# EAGLE schematic PSPS_AVNC_SRD_fullBoard-2020-05-09-2 (EAGLE 9.5.2)
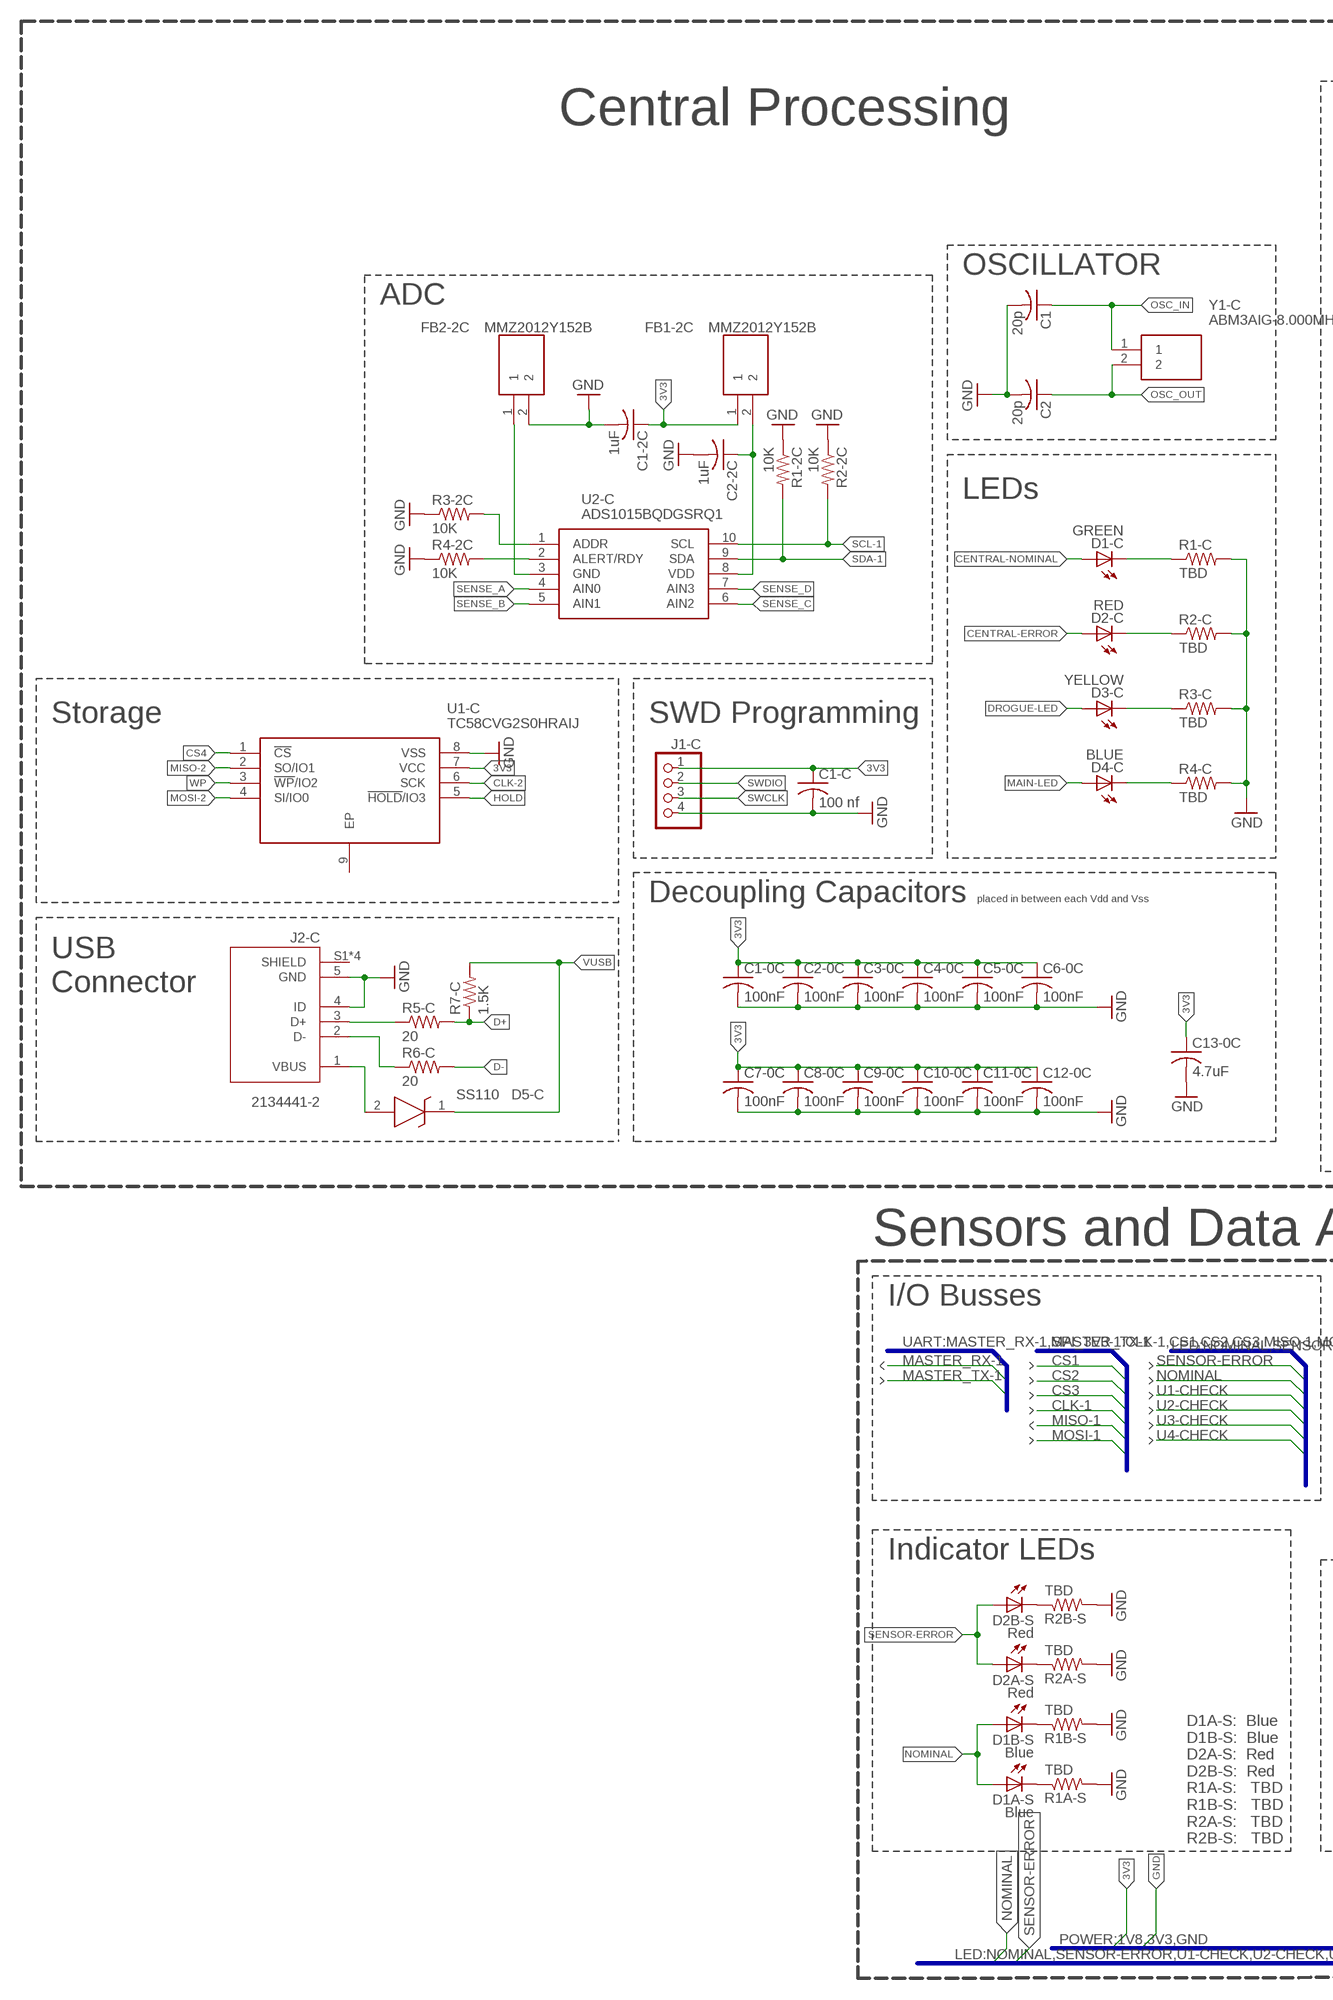
[diagram p0: schematic, sheet 1, part 1 of 3]
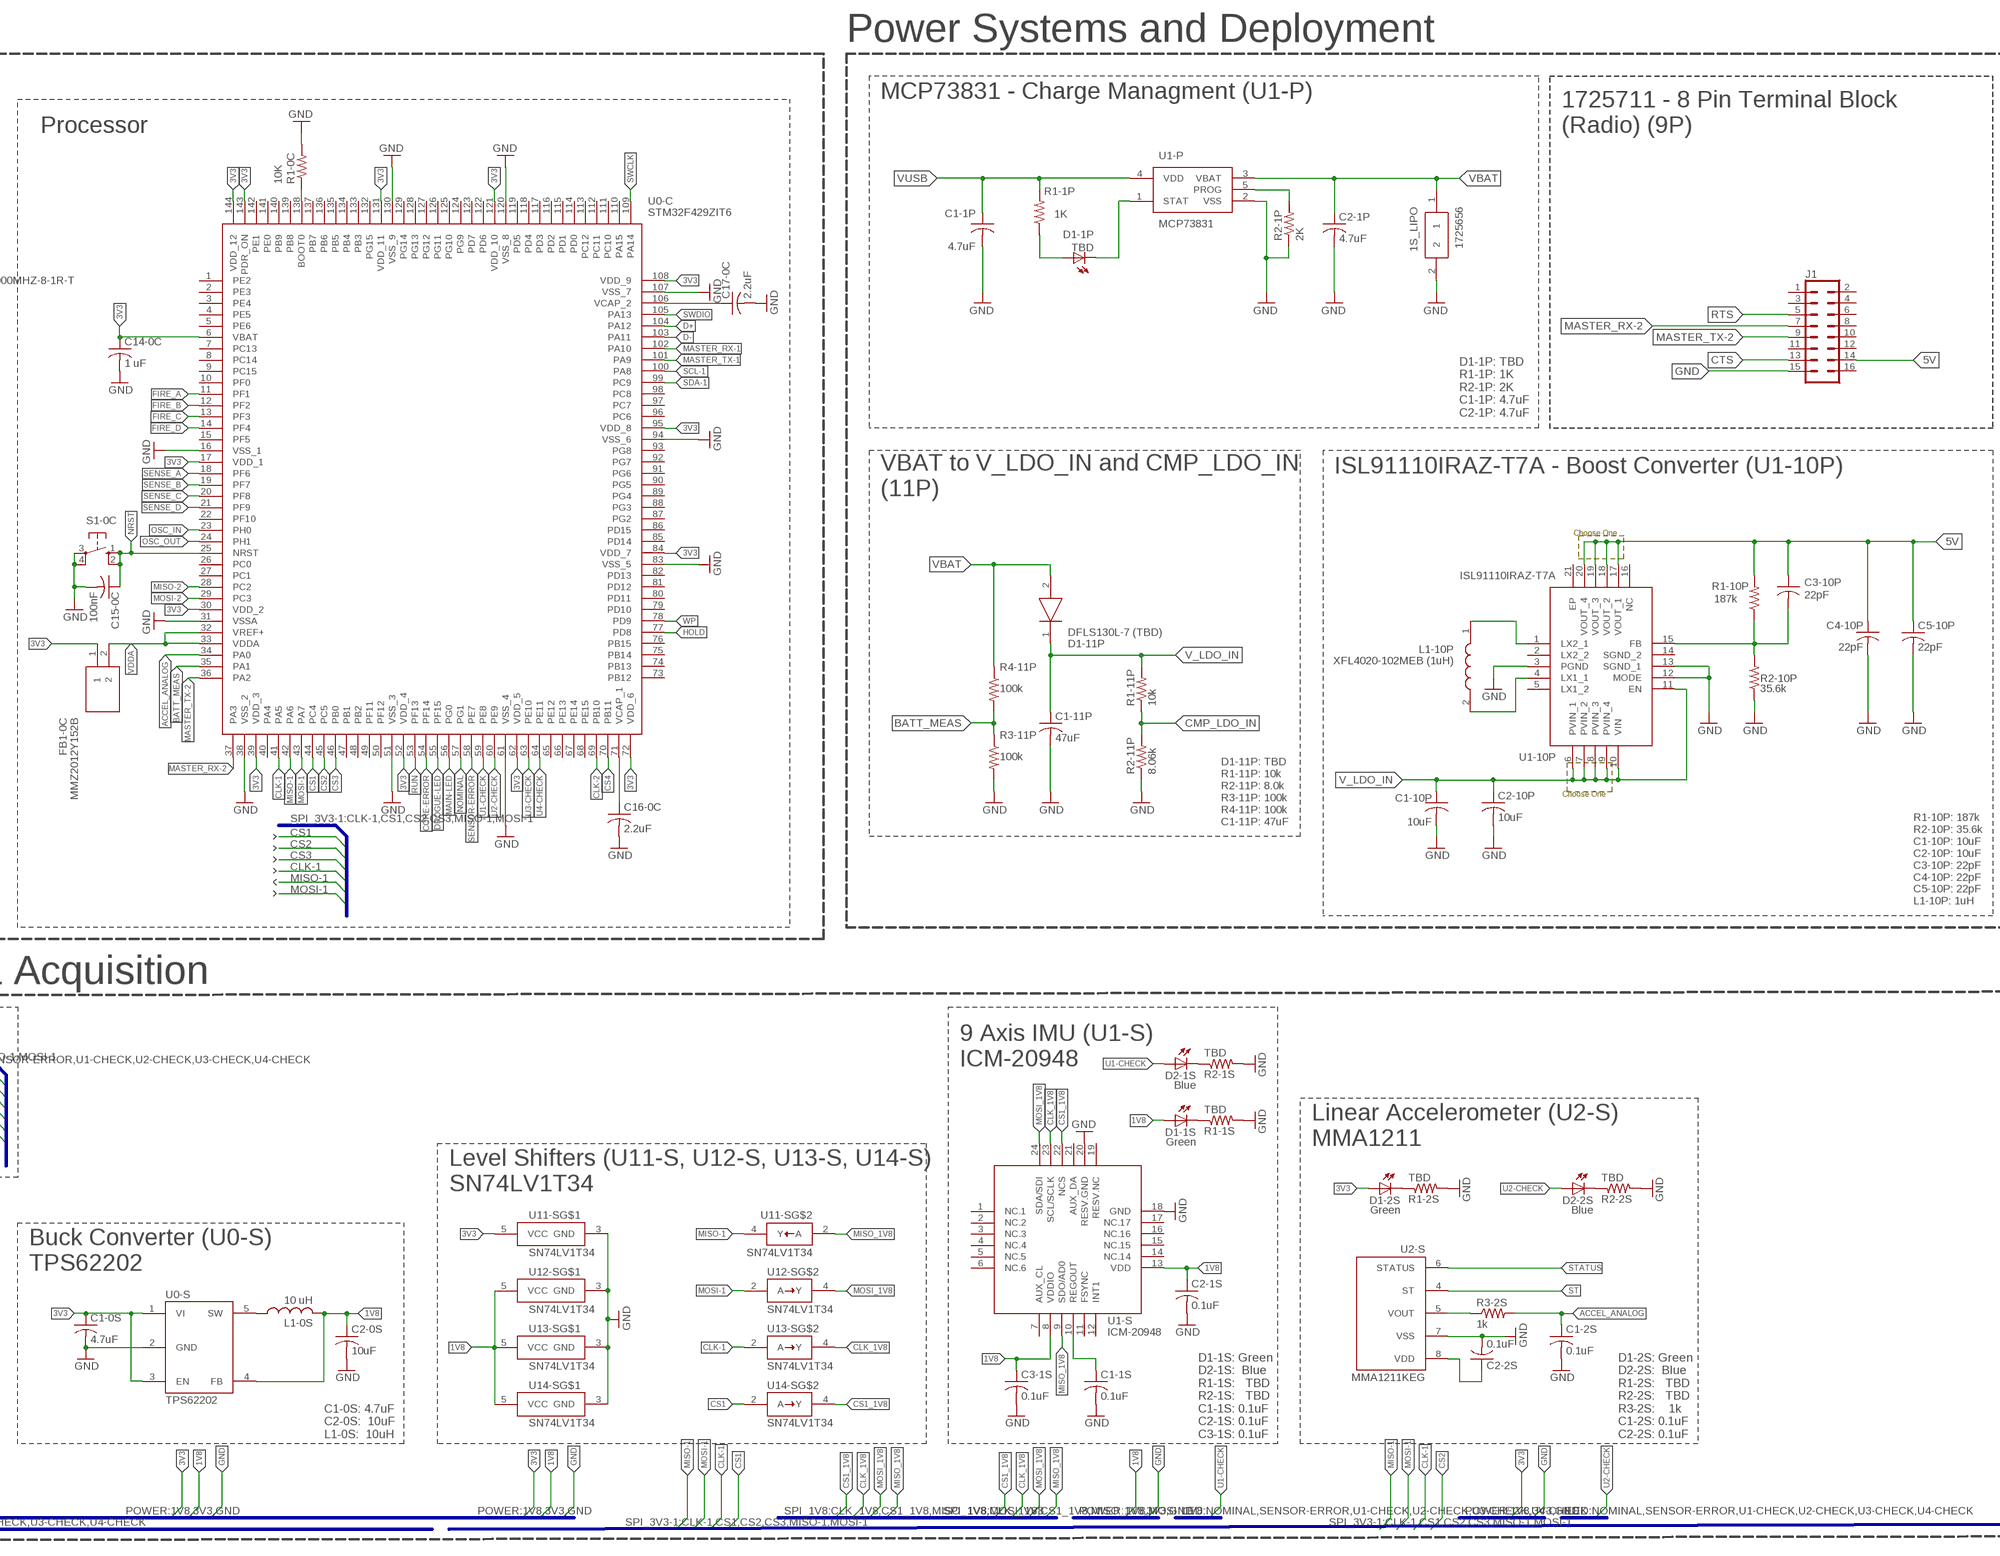
[diagram p1: schematic, sheet 1, part 2 of 3]
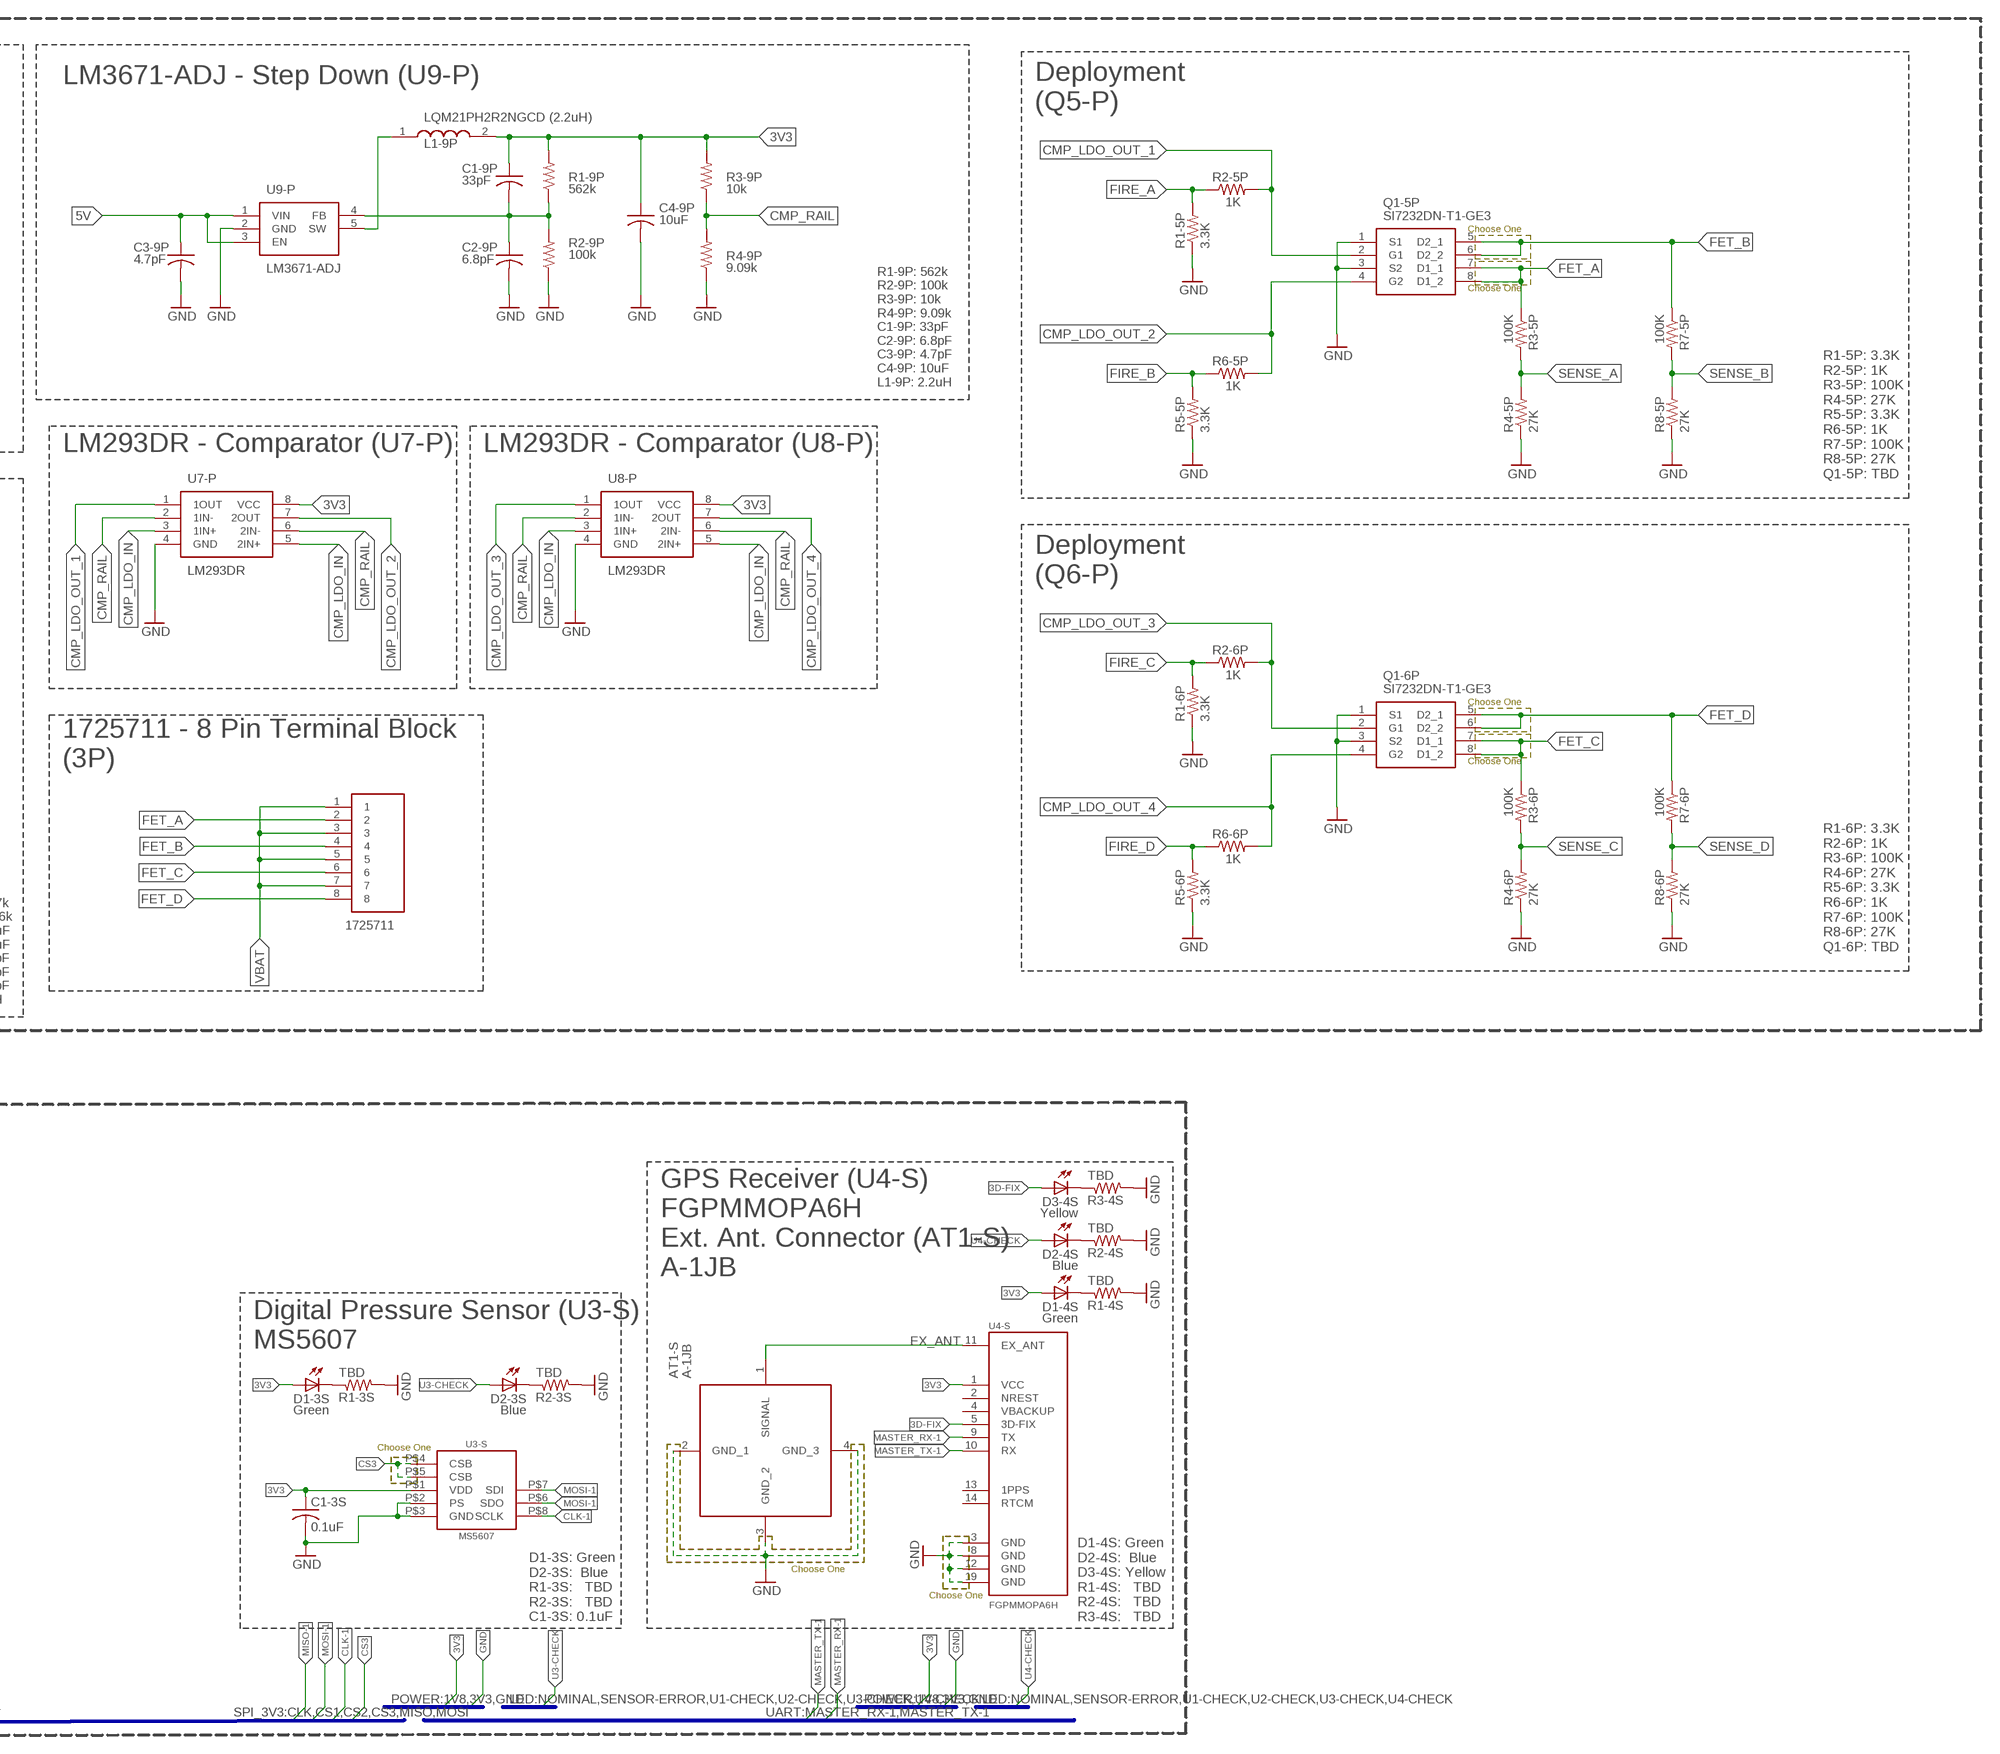
[diagram p2: schematic, sheet 1, part 3 of 3]

## Parts
1S_LIPO  1725656  [1725656]
AT1-S  A-1JB  [A1JB]
C1  20p  C-USC0805  [C0805]
C1-0C  100nF  C-USC0805  [C0805]
C1-0S  4.7uF  C-USC0805  [C0805]
C1-1P  4.7uF  C-USC0805  [C0805]
C1-1S  0.1uF  C-USC0805  [C0805]
C1-2C  1uF  C-USC0805  [C0805]
C1-2S  0.1uF  C-USC0805  [C0805]
C1-3S  0.1uF  C-USC0805  [C0805]
C1-9P  33pF  C-USC0805  [C0805]
C1-10P  10uF  C-USC0805  [C0805]
C1-11P  47uF  C-USC0805  [C0805]
C1-C  100 nf  C-USC0805  [C0805]
C2  20p  C-USC0805  [C0805]
C2-0C  100nF  C-USC0805  [C0805]
C2-0S  10uF  C-USC0805  [C0805]
C2-1P  4.7uF  C-USC0805  [C0805]
C2-1S  0.1uF  C-USC0805  [C0805]
C2-2C  1uF  C-USC0805  [C0805]
C2-2S  0.1uF  C-USC0805  [C0805]
C2-9P  6.8pF  C-USC0805  [C0805]
C2-10P  10uF  C-USC0805  [C0805]
C3-0C  100nF  C-USC0805  [C0805]
C3-1S  0.1uF  C-USC0805  [C0805]
C3-9P  4.7pF  C-USC0805  [C0805]
C3-10P  22pF  C-USC0805  [C0805]
C4-0C  100nF  C-USC0805  [C0805]
C4-9P  10uF  C-USC0805  [C0805]
C4-10P  22pF  C-USC0805  [C0805]
C5-0C  100nF  C-USC0805  [C0805]
C5-10P  22pF  C-USC0805  [C0805]
C6-0C  100nF  C-USC0805  [C0805]
C7-0C  100nF  C-USC0805  [C0805]
C8-0C  100nF  C-USC0805  [C0805]
C9-0C  100nF  C-USC0805  [C0805]
C10-0C  100nF  C-USC0805  [C0805]
C11-0C  100nF  C-USC0805  [C0805]
C12-0C  100nF  C-USC0805  [C0805]
C13-0C  4.7uF  C-USC0805  [C0805]
C14-0C  1 uF  C-USC0805  [C0805]
C15-0C  100nF  C-USC0805  [C0805]
C16-0C  2.2uF  C-USC0805  [C0805]
C17-0C  2.2uF  C-USC0805  [C0805]
D1-1P  TBD  LEDCHIPLED_0805  [CHIPLED_0805]
D1-1S  Green  LEDCHIPLED_0805  [CHIPLED_0805]
D1-2S  Green  LEDCHIPLED_0805  [CHIPLED_0805]
D1-3S  Green  LEDCHIPLED_0805  [CHIPLED_0805]
D1-4S  Green  LEDCHIPLED_0805  [CHIPLED_0805]
D1-11P  DFLS130L-7 (TBD)  DFLS130L-7  [POWERDI_123]
D1-C  GREEN  LEDCHIPLED_0805  [CHIPLED_0805]
D1A-S  Blue  LEDCHIPLED_0805  [CHIPLED_0805]
D1B-S  Blue  LEDCHIPLED_0805  [CHIPLED_0805]
D2-1S  Blue  LEDCHIPLED_0805  [CHIPLED_0805]
D2-2S  Blue  LEDCHIPLED_0805  [CHIPLED_0805]
D2-3S  Blue  LEDCHIPLED_0805  [CHIPLED_0805]
D2-4S  Blue  LEDCHIPLED_0805  [CHIPLED_0805]
D2-C  RED  LEDCHIPLED_0805  [CHIPLED_0805]
D2A-S  Red  LEDCHIPLED_0805  [CHIPLED_0805]
D2B-S  Red  LEDCHIPLED_0805  [CHIPLED_0805]
D3-4S  Yellow  LEDCHIPLED_0805  [CHIPLED_0805]
D3-C  YELLOW  LEDCHIPLED_0805  [CHIPLED_0805]
D4-C  BLUE  LEDCHIPLED_0805  [CHIPLED_0805]
D5-C  SS110  [SS110]
FB1-0C  MMZ2012Y152B  [BEADC2012X105N]
FB1-2C  MMZ2012Y152B  [BEADC2012X105N]
FB2-2C  MMZ2012Y152B  [BEADC2012X105N]
J1  CONN_08X2  [2X8]
J1-C  PINHD-1X4  [1X04]
J2-C  2134441-2  [TE_2134441-2]
J2-CHARGETERMINAL  1725711  [1725711]
L1-0S  10 uH  PF0560.103NLT  [PF0560NL]
L1-9P  LQM21PH2R2NGCD (2.2uH)  LQM21PH2R2NGCD  [INDC2012X100N]
L1-10P  XFL4020-102MEB (1uH)  XFL4020-102MEB  [XFL4020]
Q1-5P  SI7232DN-T1-GE3  [POWERPAK-1212-8]
Q1-6P  SI7232DN-T1-GE3  [POWERPAK-1212-8]
R1-0C  10K  R-US_R0805  [R0805]
R1-1P  1K  R-US_R0805  [R0805]
R1-1S  TBD  R-US_R0805  [R0805]
R1-2C  10K  R-US_R0805  [R0805]
R1-2S  TBD  R-US_R0805  [R0805]
R1-3S  TBD  R-US_R0805  [R0805]
R1-4S  TBD  R-US_R0805  [R0805]
R1-5P  3.3K  R-US_M0805  [M0805]
R1-6P  3.3K  R-US_M0805  [M0805]
R1-9P  562k  R-US_R0805  [R0805]
R1-10P  187k  R-US_R0805  [R0805]
R1-11P  10k  R-US_R0805  [R0805]
R1-C  TBD  R-US_M0805  [M0805]
R1A-S  TBD  R-US_R0805  [R0805]
R1B-S  TBD  R-US_R0805  [R0805]
R2-1P  2K  R-US_R0805  [R0805]
R2-1S  TBD  R-US_R0805  [R0805]
R2-2C  10K  R-US_R0805  [R0805]
R2-2S  TBD  R-US_R0805  [R0805]
R2-3S  TBD  R-US_R0805  [R0805]
R2-4S  TBD  R-US_R0805  [R0805]
R2-5P  1K  R-US_M0805  [M0805]
R2-6P  1K  R-US_M0805  [M0805]
R2-9P  100k  R-US_R0805  [R0805]
R2-10P  35.6k  R-US_R0805  [R0805]
R2-11P  8.06k  R-US_R0805  [R0805]
R2-C  TBD  R-US_M0805  [M0805]
R2A-S  TBD  R-US_R0805  [R0805]
R2B-S  TBD  R-US_R0805  [R0805]
R3-2C  10K  R-US_R0805  [R0805]
R3-2S  1k  R-US_R0805  [R0805]
R3-4S  TBD  R-US_R0805  [R0805]
R3-5P  100K  R-US_M0805  [M0805]
R3-6P  100K  R-US_M0805  [M0805]
R3-9P  10k  R-US_R0805  [R0805]
R3-11P  100k  R-US_R0805  [R0805]
R3-C  TBD  R-US_M0805  [M0805]
R4-2C  10K  R-US_R0805  [R0805]
R4-5P  27K  R-US_M0805  [M0805]
R4-6P  27K  R-US_M0805  [M0805]
R4-9P  9.09k  R-US_R0805  [R0805]
R4-11P  100k  R-US_R0805  [R0805]
R4-C  TBD  R-US_M0805  [M0805]
R5-5P  3.3K  R-US_M0805  [M0805]
R5-6P  3.3K  R-US_M0805  [M0805]
R5-C  20  R-US_M0805  [M0805]
R6-5P  1K  R-US_M0805  [M0805]
R6-6P  1K  R-US_M0805  [M0805]
R6-C  20  R-US_M0805  [M0805]
R7-5P  100K  R-US_M0805  [M0805]
R7-6P  100K  R-US_M0805  [M0805]
R7-C  1.5K  R-US_M0805  [M0805]
R8-5P  27K  R-US_M0805  [M0805]
R8-6P  27K  R-US_M0805  [M0805]
S1-0C  10-XX  [B3F-10XX]
U0-C  STM32F429ZIT6  [QFP50P2200X2200X160-144N]
U0-S  TPS62202  [SOT95P280X145-5]
U1-10P  ISL91110IRAZ-T7A  [QFN50P400X400X100-21N]
U1-C  TC58CVG2S0HRAIJ  [SON127P800X600X80-9N]
U1-P  MCP73831  MCP73831T-2ACI_OT  [SOT95P270X145-5N]
U1-S  ICM-20948  [QFN40P300X300X105-25T159X175]
U2-C  ADS1015BQDGSRQ1  [SOP50P490X110-10N]
U2-S  MMA1211KEG  [SOIC127P1041X355-16N]
U3-S  MS5607  [MS5607]
U4-S  FGPMMOPA6H  [SOIC127P1800X470-20N]
U7-P  LM293DR  [SOIC127P600X175-8N]
U8-P  LM293DR  [SOIC127P600X175-8N]
U9-P  LM3671-ADJ  LM3671MFX-ADJ_NOPB  [SOT95P280X145-5N]
U11-S  SN74LV1T34  [SOT65P210X110-5]
U12-S  SN74LV1T34  [SOT65P210X110-5]
U13-S  SN74LV1T34  [SOT65P210X110-5]
U14-S  SN74LV1T34  [SOT65P210X110-5]
Y1-C  ABM3AIG-8.000MHZ-8-1R-T  [ABM3AIG8000MHZ81RT]

## Nets
1V8: C2-0S.1 C2-1S.1 C3-1S.1 D1-1S.A L1-0S.P$2 U0-S.4(FB) U1-S.8(VDDIO) U1-S.13(VDD) U12-S.5(VCC) U13-S.5(VCC) U14-S.5(VCC)
3D-FIX: D3-4S.A U4-S.5(3D-FIX)
3V3: C1-0C.1 C1-0S.1 C1-2C.1 C1-3S.1 C1-9P.1 C1-C.1 C2-0C.1 C3-0C.1 C4-0C.1 C4-9P.1 C5-0C.1 C6-0C.1 C7-0C.1 C8-0C.1 C9-0C.1 C10-0C.1 C11-0C.1 C12-0C.1 C13-0C.1 C14-0C.1 D1-2S.A D1-3S.A D1-4S.A FB1-0C.1 FB1-2C.1 J1-C.1 L1-9P.2 R1-9P.2 R3-9P.2 U0-C.6(VBAT) U0-C.17(VDD_1) U0-C.30(VDD_2) U0-C.39(VDD_3) U0-C.52(VDD_4) U0-C.62(VDD_5) U0-C.72(VDD_6) U0-C.84(VDD_7) U0-C.95(VDD_8) U0-C.108(VDD_9) U0-C.121(VDD_10) U0-C.131(VDD_11) U0-C.143(PDR_ON) U0-C.144(VDD_12) U0-S.1(VI) U0-S.3(EN) U1-C.7(VCC) U3-S.P$1(VDD) U4-S.1(VCC) U7-P.8(VCC) U8-P.8(VCC) U11-S.5(VCC)
3V3-U2-CA: C2-2C.1 FB1-2C.2 U2-C.8(VDD)
5V: C3-9P.1 C3-10P.1 C4-10P.1 C5-10P.1 J1.14 R1-10P.2 U1-10P.17(VOUT_1) U1-10P.18(VOUT_2) U1-10P.19(VOUT_3) U1-10P.20(VOUT_4) U9-P.1(VIN) U9-P.3(EN)
ACCEL_ANALOG: C1-2S.1 R3-2S.2 U0-C.34(PA0)
ADDR: R3-2C.2 U2-C.1(ADDR)
ALERT: R4-2C.2 U2-C.2(ALERT/RDY)
BATT_MEAS: R3-11P.1 R4-11P.2 U0-C.35(PA1)
BOOT0: R1-0C.1 U0-C.138(BOOT0)
CENTRAL-ERROR: D2-C.A
CENTRAL-NOMINAL: D1-C.A
CLK-1: U0-C.41(PA5) U3-S.P$8(SCLK) U13-S.2(A)
CLK-2: U0-C.69(PB10) U1-C.6(SCK)
CLK_1V8: U1-S.23(SCL/SCLK) U13-S.4(Y)
CMP_LDO_IN: R1-11P.1 R2-11P.2 U7-P.3(1IN+) U7-P.5(2IN+) U8-P.3(1IN+) U8-P.5(2IN+)
CMP_LDO_OUT_1: Q1-5P.2(G1) R2-5P.2 U7-P.1(1OUT)
CMP_LDO_OUT_2: Q1-5P.4(G2) R6-5P.2 U7-P.7(2OUT)
CMP_LDO_OUT_3: Q1-6P.2(G1) R2-6P.2 U8-P.1(1OUT)
CMP_LDO_OUT_4: Q1-6P.4(G2) R6-6P.2 U8-P.7(2OUT)
CMP_RAIL: R3-9P.1 R4-9P.2 U7-P.2(1IN-) U7-P.6(2IN-) U8-P.2(1IN-) U8-P.6(2IN-)
CORE-ERROR: U0-C.54(PF14)
CS1: U0-C.44(PC4) U14-S.2(A)
CS1_1V8: U1-S.22(NCS) U14-S.4(Y)
CS2: U0-C.45(PC5)
CS3: U0-C.46(PB0) U3-S.P$4(CSB) U3-S.P$5(CSB)
CS4: U0-C.70(PB11) U1-C.1(!CS)
CTS: J1.13
D1-1S_R1-1S: D1-1S.C R1-1S.1
D1-2S_R1-2S: D1-2S.C R1-2S.1
D1-3S_R1-3S: D1-3S.C R1-3S.1
D1-4S_R1-4S: D1-4S.C R1-4S.1
D1-C_R1-C: D1-C.C R1-C.1
D1A-S_R1A-S: D1A-S.C R1A-S.1
D1B-S_R1B-S: D1B-S.C R1B-S.1
D2-1S_R2-1S: D2-1S.C R2-1S.1
D2-2S_R2-2S: D2-2S.C R2-2S.1
D2-3S_R2-3S: D2-3S.C R2-3S.1
D2-4S_R2-4S: D2-4S.C R2-4S.1
D2-C_R2-C: D2-C.C R2-C.1
D2A-S_R2A-S: D2A-S.C R2A-S.1
D2B-S_R2B-S: D2B-S.C R2B-S.1
D3-4S_R3-4S: D3-4S.C R3-4S.1
D3-C_R3-C: D3-C.C R3-C.1
D4-C_R4-C: D4-C.C R4-C.1
D+: R5-C.2 R7-C.1 U0-C.104(PA12)
D-: R6-C.2 U0-C.103(PA11)
DROGUE-LED: D3-C.A U0-C.55(PF15)
EX_ANT: AT1-S.1(SIGNAL) U4-S.11(EX_ANT)
FET_A: J2-CHARGETERMINAL.2 Q1-5P.7(D1_1) Q1-5P.8(D1_2) R3-5P.1
FET_B: J2-CHARGETERMINAL.4 Q1-5P.5(D2_1) Q1-5P.6(D2_2) R7-5P.1
FET_C: J2-CHARGETERMINAL.6 Q1-6P.7(D1_1) Q1-6P.8(D1_2) R3-6P.1
FET_D: J2-CHARGETERMINAL.8 Q1-6P.5(D2_1) Q1-6P.6(D2_2) R7-6P.1
FIRE_A: R1-5P.2 R2-5P.1 U0-C.11(PF1)
FIRE_B: R5-5P.2 R6-5P.1 U0-C.12(PF2)
FIRE_C: R1-6P.2 R2-6P.1 U0-C.13(PF3)
FIRE_D: R5-6P.2 R6-6P.1 U0-C.14(PF4)
GND: 1S_LIPO.2 AT1-S.2(GND_1) AT1-S.3(GND_2) AT1-S.4(GND_3) C1-0C.2 C1-0S.2 C1-1S.2 C1-2C.2 C1-2S.2 C1-3S.2 C1-10P.2 C1-11P.2 C1-C.2 C1.2 C2-0C.2 C2-0S.2 C2-1P.2 C2-1S.2 C2-2C.2 C2-2S.2 C2-9P.2 C2-10P.2 C2.2 C3-0C.2 C3-1S.2 C3-9P.2 C4-0C.2 C4-9P.2 C4-10P.2 C5-0C.2 C5-10P.2 C6-0C.2 C7-0C.2 C8-0C.2 C9-0C.2 C10-0C.2 C11-0C.2 C12-0C.2 C13-0C.2 C14-0C.2 C15-0C.2 C16-0C.2 C17-0C.2 FB2-2C.2 J1-C.4 J1.15 J2-C.4(ID) J2-C.5(GND) Q1-5P.1(S1) Q1-5P.3(S2) Q1-6P.1(S1) Q1-6P.3(S2) R1-0C.2 R1-1S.2 R1-2C.1 R1-2S.2 R1-3S.2 R1-4S.2 R1-5P.1 R1-6P.1 R1-C.2 R1A-S.2 R1B-S.2 R2-1P.1 R2-1S.2 R2-2C.1 R2-2S.2 R2-3S.2 R2-4S.2 R2-9P.1 R2-10P.1 R2-11P.1 R2-C.2 R2A-S.2 R2B-S.2 R3-2C.1 R3-4S.2 R3-11P.2 R3-C.2 R4-2C.1 R4-5P.1 R4-6P.1 R4-9P.1 R4-C.2 R5-5P.1 R5-6P.1 R8-5P.1 R8-6P.1 S1-0C.3(P) S1-0C.4(P1) U0-C.16(VSS_1) U0-C.31(VSSA) U0-C.38(VSS_2) U0-C.51(VSS_3) U0-C.61(VSS_4) U0-C.83(VSS_5) U0-C.94(VSS_6) U0-C.107(VSS_7) U0-C.120(VSS_8) U0-C.130(VSS_9) U0-S.2(GND) U1-10P.3(PGND) U1-10P.12(MODE) U1-10P.13(SGND_1) U1-C.8(VSS) U1-P.2(VSS) U1-S.18(GND) U1-S.20(RESV.GND) U2-S.7(VSS) U3-S.P$2(PS) U3-S.P$3(GND) U4-S.3(GND) U4-S.8(GND) U4-S.12(GND) U4-S.19(GND) U7-P.4(GND) U8-P.4(GND) U9-P.2(GND) U11-S.3(GND) U12-S.3(GND) U13-S.3(GND) U14-S.3(GND)
GND-U2-CA: FB2-2C.1 U2-C.3(GND)
HOLD: U0-C.77(PD8) U1-C.5(!HOLD!/IO3)
MAIN-LED: D4-C.A U0-C.56(PG0)
MASTER_RX-1: U0-C.102(PA10) U4-S.9(TX)
MASTER_RX-2: J1.7 U0-C.37(PA3)
MASTER_TX-1: U0-C.101(PA9) U4-S.10(RX)
MASTER_TX-2: J1.9 U0-C.36(PA2)
MISO-1: U0-C.42(PA6) U11-S.4(Y)
MISO-2: U0-C.28(PC2) U1-C.2(SO/IO1)
MISO_1V8: U1-S.9(SDO/AD0) U11-S.2(A)
MOSI-1: U0-C.43(PA7) U3-S.P$6(SDO) U3-S.P$7(SDI) U12-S.2(A)
MOSI-2: U0-C.29(PC3) U1-C.4(SI/IO0)
MOSI_1V8: U1-S.24(SDA/SDI) U12-S.4(Y)
N$1: C3-10P.2 R1-10P.1 R2-10P.2 U1-10P.15(FB)
N$3: J2-C.3(D+) R5-C.1
N$4: J2-C.2(D-) R6-C.1
N$5: C2-2S.1 U2-S.8(VDD)
N$6: C1-9P.2 C2-9P.1 R1-9P.1 R2-9P.2 U9-P.4(FB)
N$7: L1-9P.1 U9-P.5(SW)
N$8: L1-10P.1 U1-10P.1(LX2_1)
N$9: L1-10P.2 U1-10P.4(LX1_1)
N$13: D1-1P.A R1-1P.1
N$14: D1-1P.C U1-P.1(STAT)
N$16: C1-1P.2 ; supply symbol labelled GND
N$17: R2-1P.2 U1-P.5(PROG)
NOMINAL: D1A-S.A D1B-S.A U0-C.57(PG1)
NRST: C15-0C.1 S1-0C.1(S) S1-0C.2(S1) U0-C.25(NRST)
OSC_IN: C1.1 U0-C.23(PH0) Y1-C.1
OSC_OUT: C2.1 U0-C.24(PH1) Y1-C.2
REGOUT: C1-1S.1 U1-S.10(REGOUT)
RTS: J1.5
RUN: U0-C.53(PF13)
SCL-1: R2-2C.2 U0-C.100(PA8) U2-C.10(SCL)
SDA-1: R1-2C.2 U0-C.99(PC9) U2-C.9(SDA)
SENSE_A: R3-5P.2 R4-5P.2 U0-C.18(PF6) U2-C.4(AIN0)
SENSE_B: R7-5P.2 R8-5P.2 U0-C.19(PF7) U2-C.5(AIN1)
SENSE_C: R3-6P.2 R4-6P.2 U0-C.20(PF8) U2-C.6(AIN2)
SENSE_D: R7-6P.2 R8-6P.2 U0-C.21(PF9) U2-C.7(AIN3)
SENSOR-ERROR: D2A-S.A D2B-S.A U0-C.58(PE7)
ST: U2-S.4(ST)
STATUS: U2-S.6(STATUS)
SW: L1-0S.P$1 U0-S.5(SW)
SWCLK: J1-C.3 U0-C.109(PA14)
SWDIO: J1-C.2 U0-C.105(PA13)
U1-CHECK: D2-1S.A U0-C.59(PE8)
U2-CHECK: D2-2S.A U0-C.60(PE9)
U3-CHECK: D2-3S.A U0-C.63(PE10)
U4-CHECK: D2-4S.A U0-C.64(PE11)
V_LDO_IN: C1-10P.1 C1-11P.1 C2-10P.1 D1-11P.1(K) R1-11P.2 U1-10P.6(PVIN_1) U1-10P.7(PVIN_2) U1-10P.8(PVIN_3) U1-10P.9(PVIN_4) U1-10P.10(VIN) U1-10P.11(EN)
VBAT: 1S_LIPO.1 C2-1P.1 D1-11P.2(A) J2-CHARGETERMINAL.1 J2-CHARGETERMINAL.3 J2-CHARGETERMINAL.5 J2-CHARGETERMINAL.7 R4-11P.1 U1-P.3(VBAT)
VCAP_1: C16-0C.1 U0-C.71(VCAP_1)
VCAP_2: C17-0C.1 U0-C.106(VCAP_2)
VDDA: FB1-0C.2 U0-C.32(VREF+) U0-C.33(VDDA)
VOUT: R3-2S.1 U2-S.5(VOUT)
VUSB: C1-1P.1 D5-C.1(CATHODE) D5-C.2(ANODE) J2-C.1(VBUS) R1-1P.2 R7-C.2 U1-P.4(VDD)
WP: U0-C.78(PD9) U1-C.3(!WP!/IO2)
Unconnected: J1.1 J1.2 J1.3 J1.4 J1.6 J1.8 J1.10 J1.11 J1.12 J1.16 U0-C.1(PE2) U0-C.2(PE3) U0-C.3(PE4) U0-C.4(PE5) U0-C.5(PE6) U0-C.7(PC13) U0-C.8(PC14) U0-C.9(PC15) U0-C.10(PF0) U0-C.15(PF5) U0-C.22(PF10) U0-C.26(PC0) U0-C.27(PC1) U0-C.40(PA4) U0-C.47(PB1) U0-C.48(PB2) U0-C.49(PF11) U0-C.50(PF12) U0-C.65(PE12) U0-C.66(PE13) U0-C.67(PE14) U0-C.68(PE15) U0-C.73(PB12) U0-C.74(PB13) U0-C.75(PB14) U0-C.76(PB15) U0-C.79(PD10) U0-C.80(PD11) U0-C.81(PD12) U0-C.82(PD13) U0-C.85(PD14) U0-C.86(PD15) U0-C.87(PG2) U0-C.88(PG3) U0-C.89(PG4) U0-C.90(PG5) U0-C.91(PG6) U0-C.92(PG7) U0-C.93(PG8) U0-C.96(PC6) U0-C.97(PC7) U0-C.98(PC8) U0-C.110(PA15) U0-C.111(PC10) U0-C.112(PC11) U0-C.113(PC12) U0-C.114(PD0) U0-C.115(PD1) U0-C.116(PD2) U0-C.117(PD3) U0-C.118(PD4) U0-C.119(PD5) U0-C.122(PD6) U0-C.123(PD7) U0-C.124(PG9) U0-C.125(PG10) U0-C.126(PG11) U0-C.127(PG12) U0-C.128(PG13) U0-C.129(PG14) U0-C.132(PG15) U0-C.133(PB3) U0-C.134(PB4) U0-C.135(PB5) U0-C.136(PB6) U0-C.137(PB7) U0-C.139(PB8) U0-C.140(PB9) U0-C.141(PE0) U0-C.142(PE1) U1-10P.2(LX2_2) U1-10P.5(LX1_2) U1-10P.14(SGND_2) U1-10P.16(NC) U1-10P.21(EP) U1-C.9(EP) U1-S.1(NC.1) U1-S.2(NC.2) U1-S.3(NC.3) U1-S.4(NC.4) U1-S.5(NC.5) U1-S.6(NC.6) U1-S.7(AUX_CL) U1-S.11(FSYNC) U1-S.12(INT1) U1-S.14(NC.14) U1-S.15(NC.15) U1-S.16(NC.16) U1-S.17(NC.17) U1-S.19(RESV.NC) U1-S.21(AUX_DA) U4-S.2(NREST) U4-S.4(VBACKUP) U4-S.13(1PPS) U4-S.14(RTCM)

## Buses
SPI_3V3:CLK,CS1,CS2,CS3,MISO,MOSI
SPI_1V8:CLK_1V8,CS1_1V8,MISO_1V8,MOSI_1V8
POWER:1V8,3V3,GND
LED:NOMINAL,SENSOR-ERROR,U1-CHECK,U2-CHECK,U3-CHECK,U4-CHECK
UART:MASTER_RX-1,MASTER_TX-1
SPI_3V3-1:CLK-1,CS1,CS2,CS3,MISO-1,MOSI-1

## Notes on the sheet
- Power Systems and Deployment
- MCP73831 - Charge Managment (U1-P)
- LM3671-ADJ - Step Down (U9-P)
- Central Processing | Processor
- 1725711 - 8 Pin Terminal Block 
  (Radio) (9P)
- Deployment
  (Q5-P)
- Choose One
- OSCILLATOR
- ADC
- Choose One
- R1-9P: 562k
  R2-9P: 100k
  R3-9P: 10k
  R4-9P: 9.09k
  C1-9P: 33pF
  C2-9P: 6.8pF
  C3-9P: 4.7pF
  C4-9P: 10uF
  L1-9P: 2.2uH
- LEDs
- D1-1P: TBD
  R1-1P: 1K
  R2-1P: 2K
  C1-1P: 4.7uF
  C2-1P: 4.7uF
- LM293DR - Comparator (U7-P) | LM293DR - Comparator (U8-P)
- R1-5P: 3.3K
  R2-5P: 1K
  R3-5P: 100K
  R4-5P: 27K
  R5-5P: 3.3K
  R6-5P: 1K
  R7-5P: 100K
  R8-5P: 27K
  Q1-5P: TBD
- ISL91110IRAZ-T7A - Boost Converter (U1-10P)
- VBAT to V_LDO_IN and CMP_LDO_IN
  (11P)
- Choose One
- Deployment
  (Q6-P)
- Storage | SWD Programming
- Choose One
- Choose One
- 1725711 - 8 Pin Terminal Block
  (3P)
- Decoupling Capacitors | placed in between each Vdd and Vss
- USB 
  Connector
- Choose One
- D1-11P: TBD
  R1-11P: 10k
  R2-11P: 8.0k
  R3-11P: 100k
  R4-11P: 100k
  C1-11P: 47uF
- R1-6P: 3.3K
  R2-6P: 1K
  R3-6P: 100K
  R4-6P: 27K
  R5-6P: 3.3K
  R6-6P: 1K
  R7-6P: 100K
  R8-6P: 27K
  Q1-6P: TBD
- R1-10P: 187k
  R2-10P: 35.6k
  C1-10P: 10uF
  C2-10P: 10uF
  C3-10P: 22pF
  C4-10P: 22pF
  C5-10P: 22pF
  L1-10P: 1uH
- Sensors and Data Acquisition
- I/O Busses
- 9 Axis IMU (U1-S)
  ICM-20948
- GPS Receiver (U4-S)
  FGPMMOPA6H
  Ext. Ant. Connector (AT1-S)
  A-1JB
- Linear Accelerometer (U2-S)
  MMA1211
- Level Shifters (U11-S, U12-S, U13-S, U14-S)
  SN74LV1T34
- Digital Pressure Sensor (U3-S)
  MS5607
- Indicator LEDs
- Buck Converter (U0-S)
  TPS62202
- Choose One
- Choose One
- Choose One
- D1A-S:  Blue
  D1B-S:  Blue
  D2A-S:  Red
  D2B-S:  Red
  R1A-S:   TBD
  R1B-S:   TBD
  R2A-S:   TBD
  R2B-S:   TBD
- C1-0S: 4.7uF
  C2-0S:  10uF
  L1-0S:  10uH
- D1-1S: Green
  D2-1S:  Blue
  R1-1S:   TBD
  R2-1S:   TBD
  C1-1S: 0.1uF
  C2-1S: 0.1uF
  C3-1S: 0.1uF
- D1-2S: Green
  D2-2S:  Blue
  R1-2S:   TBD
  R2-2S:   TBD
  R3-2S:    1k
  C1-2S: 0.1uF
  C2-2S: 0.1uF
- D1-3S: Green
  D2-3S:  Blue
  R1-3S:   TBD
  R2-3S:   TBD
  C1-3S: 0.1uF
- D1-4S: Green
  D2-4S:  Blue
  D3-4S: Yellow
  R1-4S:   TBD
  R2-4S:   TBD
  R3-4S:   TBD

## Power pins joined to a net without a drawn wire
SHIELD: J2-C.S1(SHIELD) J2-C.S2(SHIELD) J2-C.S3(SHIELD) J2-C.S4(SHIELD)

## Library data of the parts
1S_LIPO = SamacSys_Parts:1725656: 2 way PCB vertical mount terminal,2.54mm 2 way PCB vertical mount terminal,2.54mm Source: Datasheet; DESCRIPTION: 2 way PCB vertical mount terminal,2.54mm 2 way PCB vertical mount terminal,2.54mm; HEIGHT: 8mm; MANUFACTURER_NAME: Phoenix Contact; MANUFACTURER_PART_NUMBER: 1725656; MOUSER_PART_NUMBER: 651-1725656; MOUSER_PRICE-STOCK: https://www.mouser.com/Search/Refine.aspx?Keyword=651-1725656
AT1-S = SamacSys_Parts:A-1JB: AMC Straight PCB Jack, Surface Mount Source: Datasheet; DESCRIPTION: AMC Straight PCB Jack, Surface Mount; HEIGHT: 1.05mm; MANUFACTURER_NAME: Amphenol; MANUFACTURER_PART_NUMBER: A-1JB; MOUSER_PART_NUMBER: 523-A-1JB; MOUSER_PRICE-STOCK: https://www.mouser.com/Search/Refine.aspx?Keyword=523-A-1JB
C1 C1-0C C1-2C C1-C C2 C2-0C C2-2C C3-0C C4-0C C5-0C C6-0C C7-0C C8-0C C9-0C C10-0C C11-0C C12-0C C13-0C C14-0C C15-0C C16-0C C17-0C = rcl:C-US: CAPACITOR, American symbol; SPICEPREFIX: C
C1-0S C1-1P C1-1S C1-2S C1-3S C1-9P C1-10P C1-11P C2-0S C2-1P C2-1S C2-2S C2-9P C3-1S C3-9P C3-10P C4-9P = resistor:C-US: CAPACITOR, American symbol
C2-10P C5-10P = BeagleBone_Black_Wireless:C-US: CAPACITOR, American symbol
C4-10P = resistor:C-US: CAPACITOR, American symbol; SPICEPREFIX: C
D1-1P D1-1S D1-2S D1-3S D1-4S D1-C D1A-S D1B-S D2-1S D2-2S D2-3S D2-4S D2-C D2A-S D2B-S D3-4S D3-C D4-C = adafruit:LED: LED OSRAM: - CHIPLED LG R971, LG N971, LY N971, LG Q971, LY Q971, LO R971, LY R971 LH N974, LH R974 LS Q976, LO Q976, LY Q976 LO Q996 - Hyper CHIPLED LW Q18S LB Q993, LB Q99A, LB R99A - SideLED LS A670, LO A670, LY A670, LG A670, LP A670 LB A673, LV A673, LT A673, LW A673 LH A674 LY A675 LS A676, LA A676, LO A676, LY A676, LW A676 LS A679, LY A679, LG A679 - Hyper Micro SIDELED® LS Y876, LA Y876, LO Y876, LY Y876 LT Y87S - SmartLED LW L88C, LW L88S LB L89C, LB L89S, LG L890 LS L89K, LO L89K, LY L89K LS L896, LA L896, LO L896, LY L896 - TOPLED LS T670, LO T670, LY T670, LG T670, LP T670 LSG T670, LSP T670, LSY T670, LOP T670, LYG T670 LG T671, LOG T671, LSG T671 LB T673, LV T673, LT T673, LW T673 LH T674 LS T676, LA T676, LO T676, LY T676, LB T676, LH T676, LSB T676, LW T676 LB T67C, LV T67C, LT T67C, LS T67K, LO T67K, LY T67K, LW E67C LS E67B, LA E67B, LO E67B, LY E67B, LB E67C, LV E67C, LT E67C LW T67C LS T679, LY T679, LG T679 LS T770, LO T770, LY T770, LG T770, LP T770 LB T773, LV T773, LT T773, LW T773 LH T774 LS E675, LA E675, LY E675, LS T675 LS T776, LA T776, LO T776, LY T776, LB T776 LHGB T686 LT T68C, LB T68C - Hyper Mini TOPLED® LB M676 - Mini TOPLED Santana® LG M470 LS M47K, LO M47K, LY M47K Source: http://www.osram.convergy.de/
D1-11P = SamacSys_Parts:DFLS130L-7: 1.0A SURFACE MOUNT SCHOTTKY BARRIER RECTIFIER Source: Datasheet; DESCRIPTION: 1.0A SURFACE MOUNT SCHOTTKY BARRIER RECTIFIER; HEIGHT: mm; MANUFACTURER_NAME: Diodes Inc.; MANUFACTURER_PART_NUMBER: DFLS130L-7; MOUSER_PART_NUMBER: 621-DFLS130L; MOUSER_PRICE-STOCK: https://www.mouser.com/Search/Refine.aspx?Keyword=621-DFLS130L
D5-C = SamacSys_Parts:SS110: TAIWAN SEMICONDUCTOR - SS110 - SCHOTTKY RECTIFIER, 1A, 100V, DO-214AC Source: Datasheet; DESCRIPTION: TAIWAN SEMICONDUCTOR - SS110 - SCHOTTKY RECTIFIER, 1A, 100V, DO-214AC; HEIGHT: 2.5mm; MANUFACTURER_NAME: Taiwan Semiconductor; MANUFACTURER_PART_NUMBER: SS110; MOUSER_PART_NUMBER: 821-SS110; MOUSER_PRICE-STOCK: https://www.mouser.com/Search/Refine.aspx?Keyword=821-SS110
FB1-0C FB1-2C FB2-2C = SamacSys_Parts:MMZ2012Y152B: Ferrite bead SMD 1500Ohm 500mA TDK Ferrite Bead (Chip Bead), 2 x 1.25 x 0.85mm (0805) Source: Datasheet; DESCRIPTION: Ferrite bead SMD 1500Ohm 500mA TDK Ferrite Bead (Chip Bead), 2 x 1.25 x 0.85mm (0805); HEIGHT: 1.05mm; MANUFACTURER_NAME: TDK; MANUFACTURER_PART_NUMBER: MMZ2012Y152B; MOUSER_PART_NUMBER: 810-MMZ2012Y152B; MOUSER_PRICE-STOCK: https://www.mouser.com/Search/Refine.aspx?Keyword=810-MMZ2012Y152B
J1 = SparkFun-Connectors:CONN_08X2: Multi connection point. Often used as Generic Header-pin footprint for 0.1 inch spaced/style header connections You can populate with any combo of single row headers, but if you'd like an exact match, check this: Header - 2x8 (Male, 0.1") (PRT-13156) On any of the 0.1 inch spaced packages, you can populate with these: Break Away Headers - Straight (PRT-00116) Break Away Male Headers - Right Angle (PRT-00553) Female Headers (PRT-00115) Break Away Headers - Machine Pin (PRT-00117) Break Away Female Headers - Swiss Machine Pin (PRT-00743)
J1-C = pinhead:PINHD-1X4: PIN HEADER
J2-C = 2134441-2:2134441-2: Conn Micro USB RCP 5 POS 0.65mm Solder RA SMD 5 Terminal 1 Port T/R; COMMENT: 2134441-2; DESCRIPTION: Conn Micro USB RCP 5 POS 0.65mm Solder RA SMD 5 Terminal 1 Port T/R; DIGI-KEY_PART_NUMBER: A118104CT-ND; DIGI-KEY_PURCHASE_URL: https://www.digikey.com/product-detail/en/te-connectivity-amp-connectors/2134441-2/A118104CT-ND/4729911?utm_source=snapeda&utm_medium=aggregator&utm_campaign=symbol; MF: TE Connectivity; MP: 2134441-2; PACKAGE: None; TE_PURCHASE_URL: https://www.te.com/usa-en/product-2134441-2.html?te_bu=Cor&te_type=disp&te_campaign=seda_glo_cor-seda-global-disp-prtnr-fy19-seda-model-bom-cta_sma-317_1&elqCampaignId=32493
J2-CHARGETERMINAL = SamacSys_Parts:1725711: 8 way PCB vertical mount terminal,2.54mm 8 way PCB vertical mount terminal,2.54mm Source: Datasheet; DESCRIPTION: 8 way PCB vertical mount terminal,2.54mm 8 way PCB vertical mount terminal,2.54mm; HEIGHT: mm; MANUFACTURER_NAME: Phoenix Contact; MANUFACTURER_PART_NUMBER: 1725711; MOUSER_PART_NUMBER: 651-1725711; MOUSER_PRICE-STOCK: https://www.mouser.com/Search/Refine.aspx?Keyword=651-1725711
L1-0S = Computer2:PF0560.103NLT: Fixed Inductors INDUCTOR PWR SHIELD 10UH SMD https://www.mouser.com/ProductDetail/Pulse-Electronics/PF0560103NLT?qs=sGAEpiMZZMsg%252By3WlYCkU%252BCbm%2FyM2yLshO29DWrNRHI%3D
L1-9P = SamacSys_Parts:LQM21PH2R2NGCD: LQM21PH_GC Series Inductor 2.2uH +/-30% 0805 (2012) Source: Datasheet; DESCRIPTION: LQM21PH_GC Series Inductor 2.2uH +/-30% 0805 (2012); HEIGHT: 1mm; MANUFACTURER_NAME: Murata Electronics; MANUFACTURER_PART_NUMBER: LQM21PH2R2NGCD; MOUSER_PART_NUMBER: 81-LQM21PH2R2NGCD; MOUSER_PRICE-STOCK: https://www.mouser.com/Search/Refine.aspx?Keyword=81-LQM21PH2R2NGCD
L1-10P = SamacSys_Parts:XFL4020-102MEB: Fixed Inductors XFL4020 AEC-Q200 1 uH 20% 11 A Compos Source: Datasheet; DESCRIPTION: Fixed Inductors XFL4020 AEC-Q200 1 uH 20% 11 A Compos; HEIGHT: mm; MANUFACTURER_NAME: COILCRAFT; MANUFACTURER_PART_NUMBER: XFL4020-102MEB; MOUSER_PART_NUMBER: 994-XFL4020-102MEB; MOUSER_PRICE-STOCK: https://www.mouser.com/Search/Refine.aspx?Keyword=994-XFL4020-102MEB
Q1-5P Q1-6P = SamacSys_Parts:SI7232DN-T1-GE3: Trans MOSFET N-CH 20V 10An Vishay SI7232DN-T1-GE3 Dual N-channel MOSFET Transistor, 24 A, 20 V, 8-Pin PowerPAK 1212 Source: Datasheet; DESCRIPTION: Trans MOSFET N-CH 20V 10An Vishay SI7232DN-T1-GE3 Dual N-channel MOSFET Transistor, 24 A, 20 V, 8-Pin PowerPAK 1212; HEIGHT: mm; MANUFACTURER_NAME: Vishay; MANUFACTURER_PART_NUMBER: SI7232DN-T1-GE3; MOUSER_PART_NUMBER: 781-SI7232DN-GE3; MOUSER_PRICE-STOCK: https://www.mouser.com/Search/Refine.aspx?Keyword=781-SI7232DN-GE3
R1-0C R1-2C R1-5P R1-6P R1-C R2-2C R2-5P R2-6P R2-C R3-2C R3-5P R3-6P R3-C R4-2C R4-5P R4-6P R4-C R5-5P R5-6P R5-C R6-5P R6-6P R6-C R7-5P R7-6P R7-C R8-5P R8-6P = rcl:R-US_: RESISTOR, American symbol; SPICEPREFIX: R
R1-1P R1-1S R1-2S R1-3S R1-4S R1-9P R1-10P R1-11P R1A-S R1B-S R2-1P R2-1S R2-2S R2-3S R2-4S R2-9P R2-10P R2-11P R2A-S R2B-S R3-2S R3-4S R3-9P R4-9P = resistor:R-US_: RESISTOR, American symbol
R3-11P R4-11P = PulseOximeterECG_AU:R-US_: RESISTOR, American symbol; SPICEPREFIX: R
S1-0C = switch-omron:10-XX: OMRON SWITCH; MPN: B3F-1000; OC_FARNELL: 176432; OC_NEWARK: 36M3542
U0-C = SamacSys_Parts:STM32F429ZIT6: 32-Bit MCU+FPU M4 2MB LCD-TFT LQFP144 STMicroelectronics STM32F429ZIT6, 32bit ARM Cortex M4 MCU, 180MHz, 2048 kB Flash, 144-Pin LQFP Source: Datasheet; DESCRIPTION: 32-Bit MCU+FPU M4 2MB LCD-TFT LQFP144 STMicroelectronics STM32F429ZIT6, 32bit ARM Cortex M4 MCU, 180MHz, 2048 kB Flash, 144-Pin LQFP; HEIGHT: 1.6mm; MANUFACTURER_NAME: STMicroelectronics; MANUFACTURER_PART_NUMBER: STM32F429ZIT6; MOUSER_PART_NUMBER: 511-STM32F429ZIT6; MOUSER_PRICE-STOCK: https://www.mouser.com/Search/Refine.aspx?Keyword=511-STM32F429ZIT6
U0-S = Computer2:TPS62202: 1.8-V Output, 300-mA, 95% Efficient Step-Down Converter in SOT-23 http://www.ti.com/product/TPS62202
U1-10P = SamacSys_Parts:ISL91110IRAZ-T7A: Integrated FET Regulators High Current Buck Boost Switching Regulator Delivering 2A of Continuous Output Current Source: Datasheet; DESCRIPTION: Integrated FET Regulators High Current Buck Boost Switching Regulator Delivering 2A of Continuous Output Current; HEIGHT: 1mm; MANUFACTURER_NAME: Renesas Electronics; MANUFACTURER_PART_NUMBER: ISL91110IRAZ-T7A
U1-C = SamacSys_Parts:TC58CVG2S0HRAIJ: NAND Flash 4G-bit 128M X 8bit Serial 8-Pin WSON Source: Datasheet; DESCRIPTION: NAND Flash 4G-bit 128M X 8bit Serial 8-Pin WSON; HEIGHT: 0.8mm; MANUFACTURER_NAME: Kioxia America; MANUFACTURER_PART_NUMBER: TC58CVG2S0HRAIJ; MOUSER_PART_NUMBER: 757-TC58CVG2S0HRAIJ; MOUSER_PRICE-STOCK: https://www.mouser.co.uk/ProductDetail/Kioxia-America/TC58CVG2S0HRAIJ?qs=OlC7AqGiEDkQEWU%2FaAG3Ug%3D%3D
U1-P = SamacSys_Parts:MCP73831T-2ACI_OT: Li-Ion Charge Controller 4.2V SOT23-5 Source: Datasheet; DESCRIPTION: Li-Ion Charge Controller 4.2V SOT23-5; HEIGHT: 1.45mm; MANUFACTURER_NAME: Microchip; MANUFACTURER_PART_NUMBER: MCP73831T-2ACI/OT; MOUSER_PART_NUMBER: 579-MCP73831T-2ACIOT; MOUSER_PRICE-STOCK: https://www.mouser.com/Search/Refine.aspx?Keyword=579-MCP73831T-2ACIOT
U1-S = Computer2:ICM-20948: 9 Axis Motion Sensor from TDK InvenSense https://store.invensense.com/products/detail/ICM20948-InvenSense/597203/
U2-C = SamacSys_Parts:ADS1015BQDGSRQ1: Automotive 12-Bit 3.3kSPS 4-Ch Delta-Sigma ADC With PGA, Oscillator, VREF, Comparator, and I2C Source: Datasheet; DESCRIPTION: Automotive 12-Bit 3.3kSPS 4-Ch Delta-Sigma ADC With PGA, Oscillator, VREF, Comparator, and I2C; HEIGHT: 1.1mm; MANUFACTURER_NAME: Texas Instruments; MANUFACTURER_PART_NUMBER: ADS1015BQDGSRQ1; MOUSER_PART_NUMBER: 595-ADS1015BQDGSRQ1; MOUSER_PRICE-STOCK: https://www.mouser.com/Search/Refine.aspx?Keyword=595-ADS1015BQDGSRQ1
U2-S = Computer2:MMA1211KEG
U3-S = Computer2:MS5607
U4-S = Computer2:FGPMMOPA6H
U7-P U8-P = SamacSys_Parts:LM293DR: Dual differential comparator, industrial grade Source: Datasheet; DESCRIPTION: Dual differential comparator, industrial grade; HEIGHT: 1.75mm; MANUFACTURER_NAME: Texas Instruments; MANUFACTURER_PART_NUMBER: LM293DR; MOUSER_PART_NUMBER: 595-LM293DR; MOUSER_PRICE-STOCK: https://www.mouser.com/Search/Refine.aspx?Keyword=595-LM293DR
U9-P = SamacSys_Parts:LM3671MFX-ADJ_NOPB: 2MHz, 600mA Step-Down DC-DC Converter Source: Datasheet; DESCRIPTION: 2MHz, 600mA Step-Down DC-DC Converter; HEIGHT: 1.45mm; MANUFACTURER_NAME: Texas Instruments; MANUFACTURER_PART_NUMBER: LM3671MFX-ADJ/NOPB; MOUSER_PART_NUMBER: 926-LM3671MFXADJNOPB; MOUSER_PRICE-STOCK: https://www.mouser.com/Search/Refine.aspx?Keyword=926-LM3671MFXADJNOPB
U11-S U12-S U13-S U14-S = Computer2:SN74LV1T34: Single Power Supply BUFFER Logic Level Shifter
Y1-C = SamacSys_Parts:ABM3AIG-8.000MHZ-8-1R-T: Crystals 8pF 8MHz 10ppm AEC-Q200 -40C +150C Source: Datasheet; DESCRIPTION: Crystals 8pF 8MHz 10ppm AEC-Q200 -40C +150C; HEIGHT: 1.55mm; MANUFACTURER_NAME: ABRACON; MANUFACTURER_PART_NUMBER: ABM3AIG-8.000MHZ-8-1R-T; MOUSER_PART_NUMBER: 815-M3AIG-8-8-1RT; MOUSER_PRICE-STOCK: https://www.mouser.co.uk/ProductDetail/ABRACON/ABM3AIG-8000MHZ-8-1R-T?qs=uwxL4vQweFOO5Dqed3UFcg%3D%3D

## Module LEVEL_SHIFTERS
Ports: 

### Library data of the parts